# EAGLE design CS-N-CON-10X-100 (EAGLE 6.5.0)
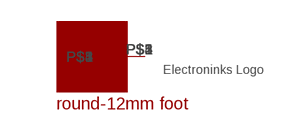
[diagram p0: schematic, sheet 1]

## Parts
U$1  ROUND-12MM-FOOT-1.8MM  [ROUND-12MM-FOOT]
U$2  ELECTRONINKS_LOGO_10MM  [ELECTRONINKS_LOGO_10MM]
Unconnected: U$1.P$1 U$1.P$2 U$1.P$3 U$1.P$4 U$1.P$5

## Library data of the parts
U$1 = electroninks:ROUND-12MM-FOOT-1.8MM
U$2 = electroninks:ELECTRONINKS_LOGO_10MM

## Board
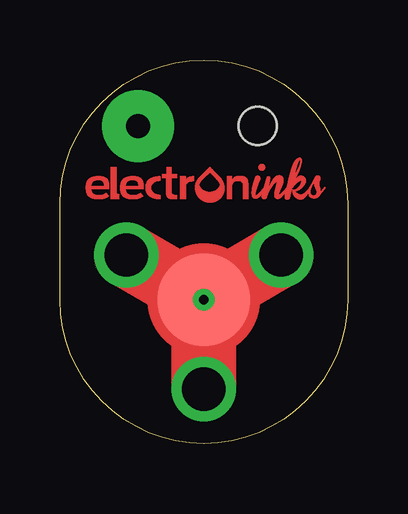
[diagram p1: board, top side]
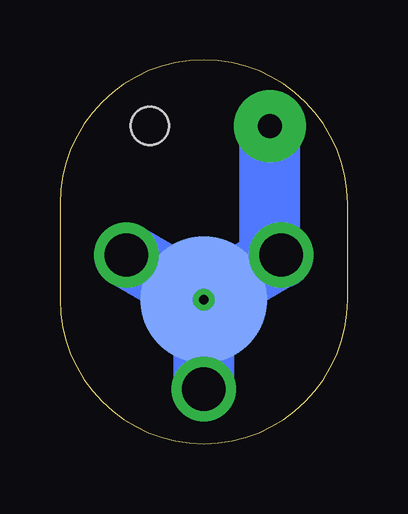
[diagram p2: board, bottom side, seen from below]

Size 12 x 16 mm. Coordinates in mm from the lower left corner, seen from the top.
Outline: 12,6 arc-180 0,6 0,10 arc-180 12,10 12,6
Copper layers (1*16): Top 0.035mm / dielectric 1.5mm / Bottom 0.035mm
Design rules "default": minimum track width 10mil, minimum drill 24mil, track to track 8mil, track to pad 8mil, pad to pad 8mil, via to via 8mil, smd to smd 8mil, copper to edge 40mil, drill to drill 8mil, minimum pad ring 10mil, minimum via ring 8mil, stop-mask expansion 4mil, vias tented up to drill 0mil, thermal gap 10mil
Holes 1.6 mm at 8.25,13.25

### Footprints (pad centres in the part's own frame; a part is rotated, then mirrored left to right if it is on the bottom)
ROUND-12MM-FOOT = drill 1.8: P$1 -3.726,0; P$2 1.863,3.227; P$3 1.863,-3.227 | smd 3.85 x 3.85: P$4 0,0 | smd 5.3 x 5.3 bottom: P$5 0,0 | drill 0.4: P$6 0,0

### Placement (x,y rotation side)
U$1  6,6 90 top
U$2  1.08,10.05 0 top

### Tracks (layer width: path | path; a pad name or v marks a point on that pad's centre or on a via)
N$1  (via drill 1 pad 3)
  Bottom 2.54: 2.75,7.75 3.25,7.75 v3.25,13.25